# Altium schematic sheet L293D.SchDoc: LV8731
size 279 x 152 mm; Author: SchumyHao; DocumentNumber: 2; Revision: V01; SheetNumber: 2; SheetTotal: 7
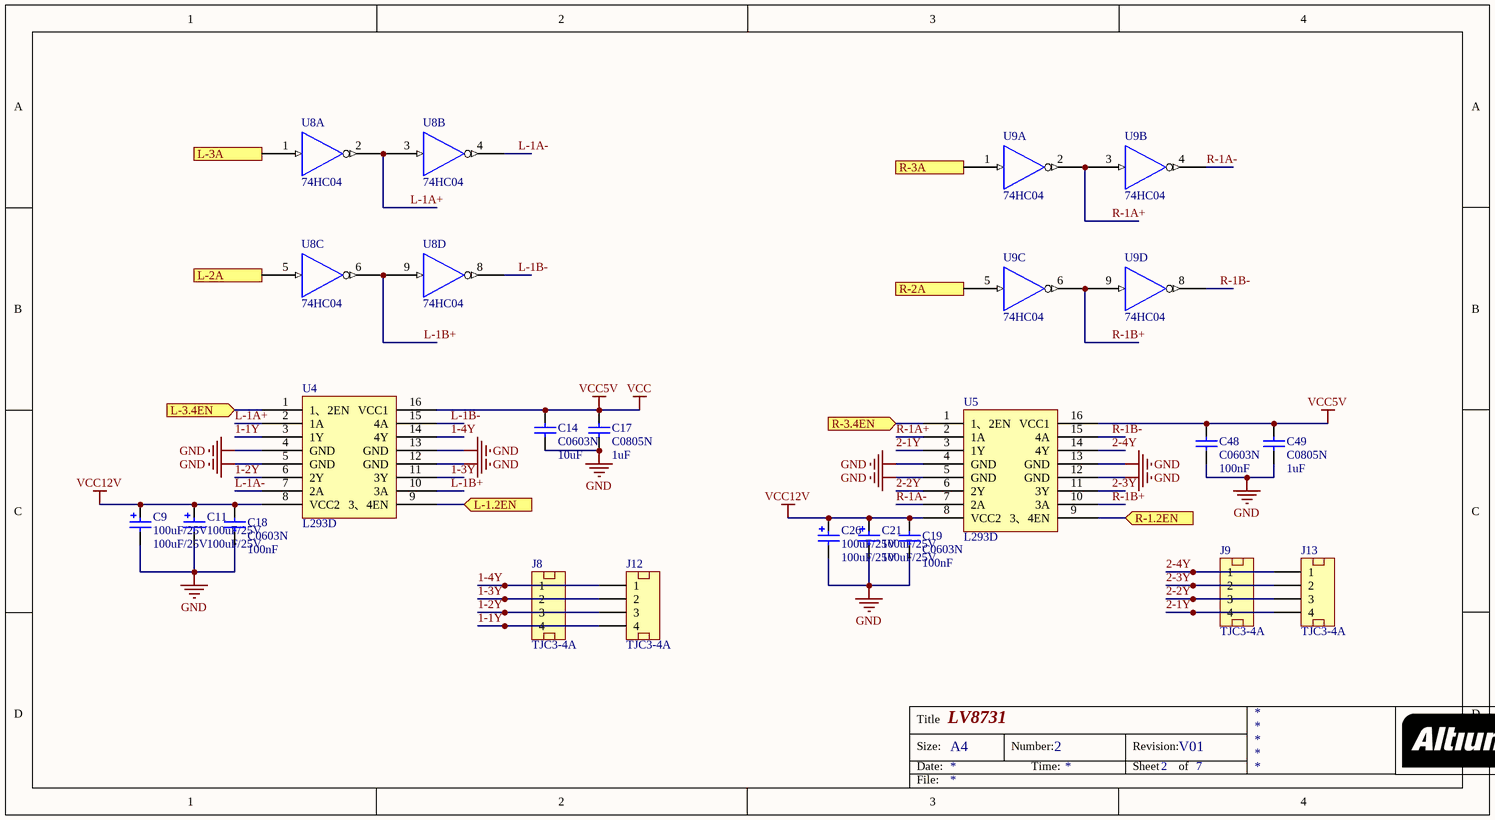
[diagram p0: L293D.SchDoc]

## Parts
C9  100uF/25V  [16V220uF]
C11  100uF/25V  [16V220uF]
C14  C0603N  value 10uF  [C0603N]
C17  C0805N  value 1uF  [C0805N]
C18  C0603N  value 100nF  [C0603N]
C19  C0603N  value 100nF  [C0603N]
C21  100uF/25V  [16V220uF]
C26  100uF/25V  [16V220uF]
C48  C0603N  value 100nF  [C0603N]
C49  C0805N  value 1uF  [C0805N]
J8  TJC3-4A  [TJC3-4A]
J9  TJC3-4A  [TJC3-4A]
J12  TJC3-4A  [PH4.0-L]
J13  TJC3-4A  [PH4.0-L]
U4  L293D  [DIP16]
U5  L293D  [DIP16]
U8  74HC04  [SOP14]  (parts A,B,C,D of 6)
U9  74HC04  [SOP14]  (parts A,B,C,D of 6)

## Ports
L-1.2EN (in), L-2A (in), L-3.4EN (in), L-3A (in), R-1.2EN (in), R-2A (in), R-3.4EN (in), R-3A (in)

## Nets
GND: C9.2 C11.2 C14.2 C17.1 C18.1 C19.1 C21.2 C26.2 C48.1 C49.1 U4.4(GND) U4.5(GND) U4.12(GND) U4.13(GND) U5.4(GND) U5.5(GND) U5.12(GND) U5.13(GND) U8.7(GND) U9.7(GND)
VCC: C14.1 C17.2 C48.2 C49.2 U4.16(VCC1) U5.16(VCC1) U8.14(VCC) U9.14(VCC)  [also labelled VCC5V]
VCC12V: C9.1 C11.1 C18.2 C19.2 C21.1 C26.1 U4.8(VCC2) U5.8(VCC2)
1-1Y: J8.4 J12.4 U4.3(1Y)
1-2Y: J8.3 J12.3 U4.6(2Y)
1-3Y: J8.2 J12.2 U4.11(3Y)
1-4Y: J8.1 J12.1 U4.14(4Y)
2-1Y: J9.4 J13.4 U5.3(1Y)
2-2Y: J9.3 J13.3 U5.6(2Y)
2-3Y: J9.2 J13.2 U5.11(3Y)
2-4Y: J9.1 J13.1 U5.14(4Y)
L-1.2EN: U4.9(3、4EN) ; port L-1.2EN
L-1A+: U4.2(1A) U8.2 U8.3
L-1A-: U4.7(2A) U8.4
L-1B+: U4.10(3A) U8.6 U8.9
L-1B-: U4.15(4A) U8.8
L-2A: U8.5 ; port L-2A
L-3.4EN: U4.1(1、2EN) ; port L-3.4EN
L-3A: U8.1 ; port L-3A
R-1.2EN: U5.9(3、4EN) ; port R-1.2EN
R-1A+: U5.2(1A) U9.2 U9.3
R-1A-: U5.7(2A) U9.4
R-1B+: U5.10(3A) U9.6 U9.9
R-1B-: U5.15(4A) U9.8
R-2A: U9.5 ; port R-2A
R-3.4EN: U5.1(1、2EN) ; port R-3.4EN
R-3A: U9.1 ; port R-3A

## Notes on the sheet
- Title
- Size:
- Date:
- A4
- Number:
- Time:
- Revision:
- Sheet
- of
- File:

## Library data of the parts
C9 C11 C21 C26 = Cap Pol3: Polarized Capacitor (Surface Mount); Value: 100uF/25V
C14 C17-C19 C48 C49 = Cap Semi: Capacitor (Semiconductor SIM Model)
J8 J9 J12 J13 = TJC3-4A: Set Position: 0.5; Published: 8-Jun-2000; LatestRevisionDate: 17-Jul-2002; LatestRevisionNote: Re-released for DXP Platform.; PackageReference: AXIAL-0.6; Publisher: Altium Limited